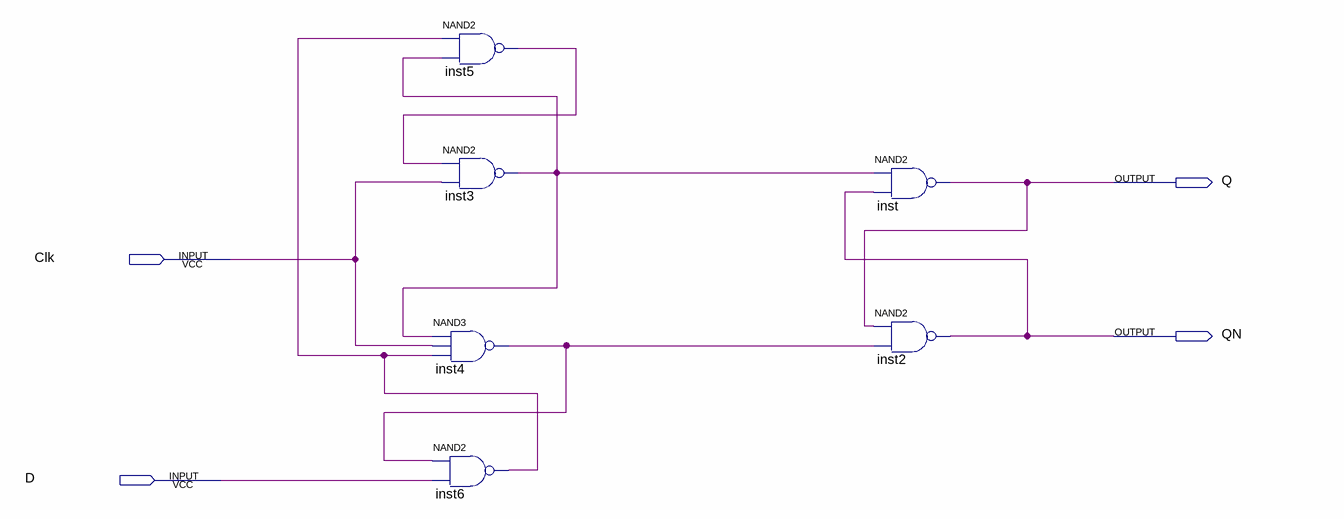
[diagram p0: schematic sheet]
// Quartus schematic lab9step3b.bdf as structural Verilog: 6 symbols, 4 pins
module lab9step3b (
  input  Clk,
  input  D,
  output Q,
  output QN
);

  wire inst3_out, inst4_out, inst5_out, inst6_out;

  nand inst5 (inst5_out, inst6_out, inst3_out);
  nand inst3 (inst3_out, inst5_out, Clk);
  nand inst4 (inst4_out, inst3_out, Clk, inst6_out);
  nand inst6 (inst6_out, inst4_out, D);
  nand inst (Q, inst3_out, QN);
  nand inst2 (QN, Q, inst4_out);
endmodule
